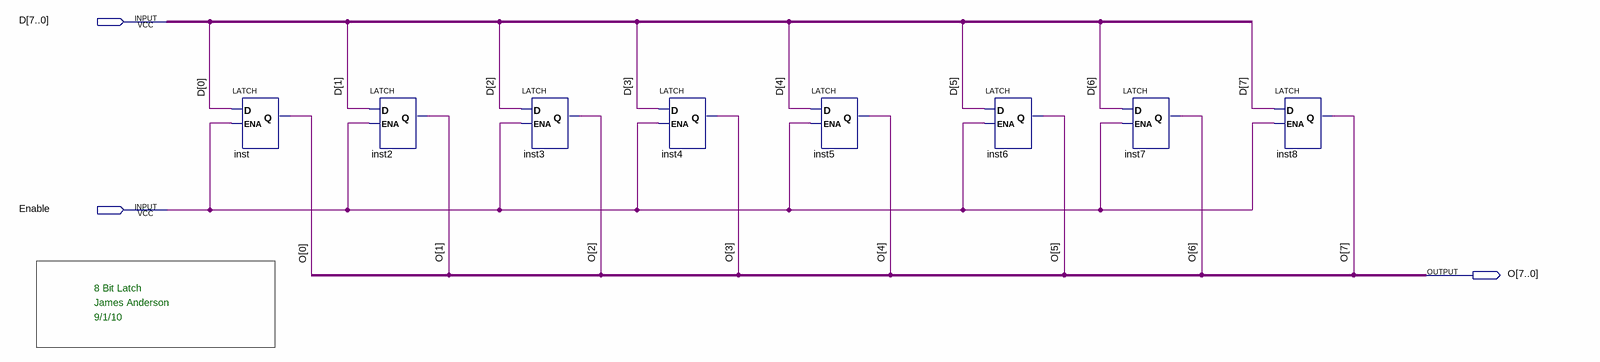
[diagram p0: schematic sheet]
// Quartus schematic 8bitlatch.bdf as structural Verilog: 8 symbols, 3 pins
module \8bitlatch  (
  input  [7:0] D,
  input  Enable,
  output [7:0] O
);

  LATCH inst (.D(D[0]), .ENA(Enable), .Q(O[0]));
  LATCH inst2 (.D(D[1]), .ENA(Enable), .Q(O[1]));
  LATCH inst3 (.D(D[2]), .ENA(Enable), .Q(O[2]));
  LATCH inst4 (.D(D[3]), .ENA(Enable), .Q(O[3]));
  LATCH inst5 (.D(D[4]), .ENA(Enable), .Q(O[4]));
  LATCH inst6 (.D(D[5]), .ENA(Enable), .Q(O[5]));
  LATCH inst7 (.D(D[6]), .ENA(Enable), .Q(O[6]));
  LATCH inst8 (.D(D[7]), .ENA(Enable), .Q(O[7]));

  // Notes on the sheet:
  //   8 Bit Latch
  //   James Anderson
  //   9/1/10
endmodule
